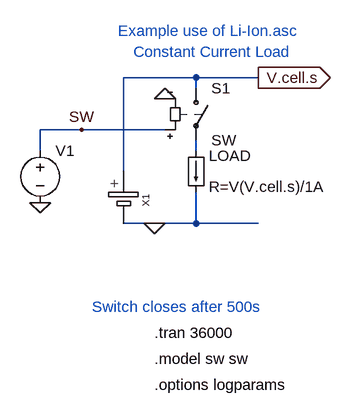
[diagram p0: schematic Constant-Current-Example.asc]
Constant-Current-Example.asc, the LTspice schematic file:
Version 4.1
SHEET 1 880 680
WIRE 240 -16 128 -16
WIRE 336 -16 240 -16
WIRE 240 0 240 -16
WIRE 64 64 0 64
WIRE 192 64 64 64
WIRE 0 96 0 64
WIRE 240 96 240 80
WIRE 128 128 128 -16
WIRE 176 208 128 208
WIRE 240 208 240 160
WIRE 240 208 176 208
WIRE 336 208 240 208
FLAG 176 208 0
FLAG 336 -16 V.cell.s
IOPIN 336 -16 Out
FLAG 192 16 0
FLAG 0 176 0
FLAG 64 64 SW
SYMBOL Li-Ion 0 176 R0
SYMATTR InstName X1
SYMATTR Description Lithium-In Battery
SYMBOL load 224 96 R0
SYMATTR InstName LOAD
SYMATTR Value R=V(V.cell.s)/1A
SYMATTR Prefix B
SYMBOL sw 240 -16 R0
SYMATTR InstName S1
SYMBOL voltage 0 80 R0
WINDOW 3 -86 251 Invisible 2
WINDOW 123 0 0 Left 0
WINDOW 39 0 0 Left 0
SYMATTR InstName V1
SYMATTR Value PULSE(-1 1 500 1m 1m 50000 50000 1)
TEXT 144 -56 Left 2 ;Constant Current Load
TEXT 176 376 Left 2 !.tran 36000
TEXT 176 416 Left 2 !.model sw sw
TEXT 80 336 Left 2 ;Switch closes after 500s
TEXT 120 -88 Left 2 ;Example use of Li-Ion.asc
TEXT 176 456 Left 2 !.options logparams

The netlist it stands for:
* Constant-Current-Example.asc
X§X1 V.cell.s 0 Li-Ion  ; pins cell+ cell-
B§LOAD N001 0 R=V(V.cell.s)/1A
S1 V.cell.s N001 SW 0 SW
V1 SW 0 PULSE(-1 1 500 1m 1m 50000 50000 1)
* Constant Current Load
.tran 36000
.model sw sw
* Switch closes after 500s
* Example use of Li-Ion.asc
.options logparams
.backanno
.end